# EAGLE board V2.1_BMS (EAGLE 9.6.2)
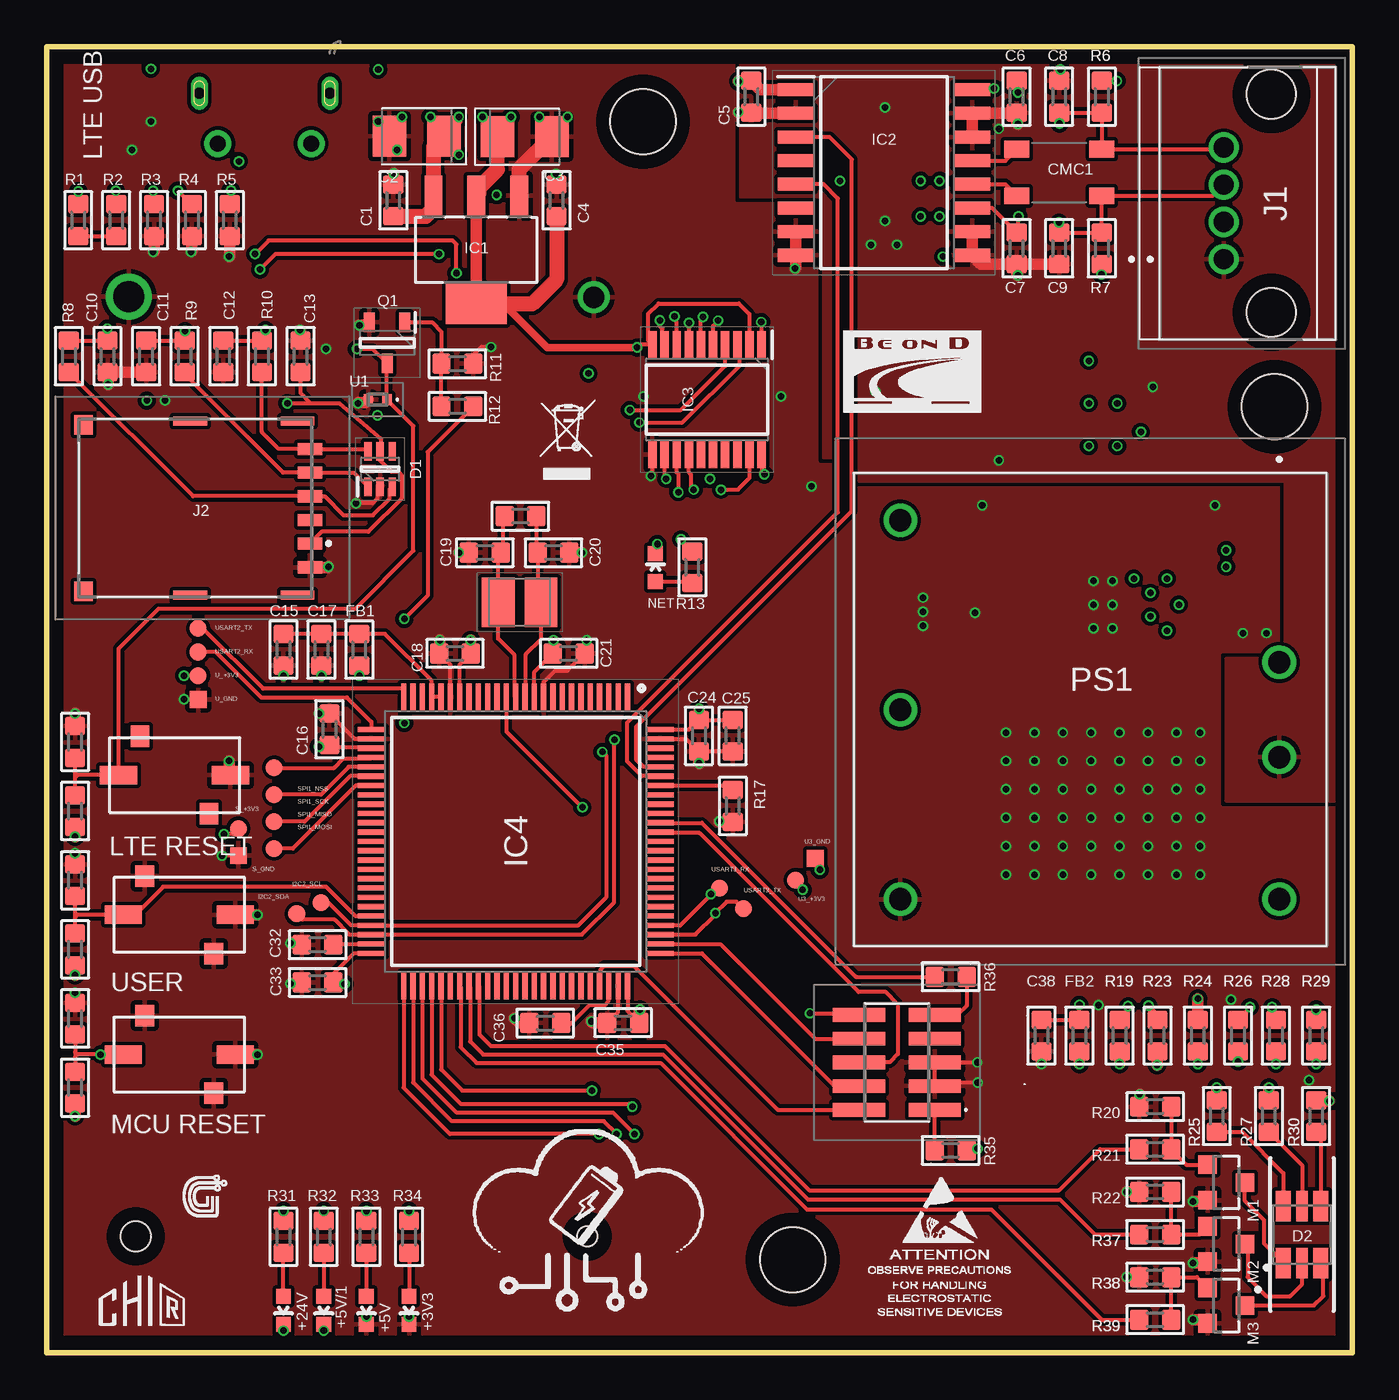
[diagram p7: board, top side]
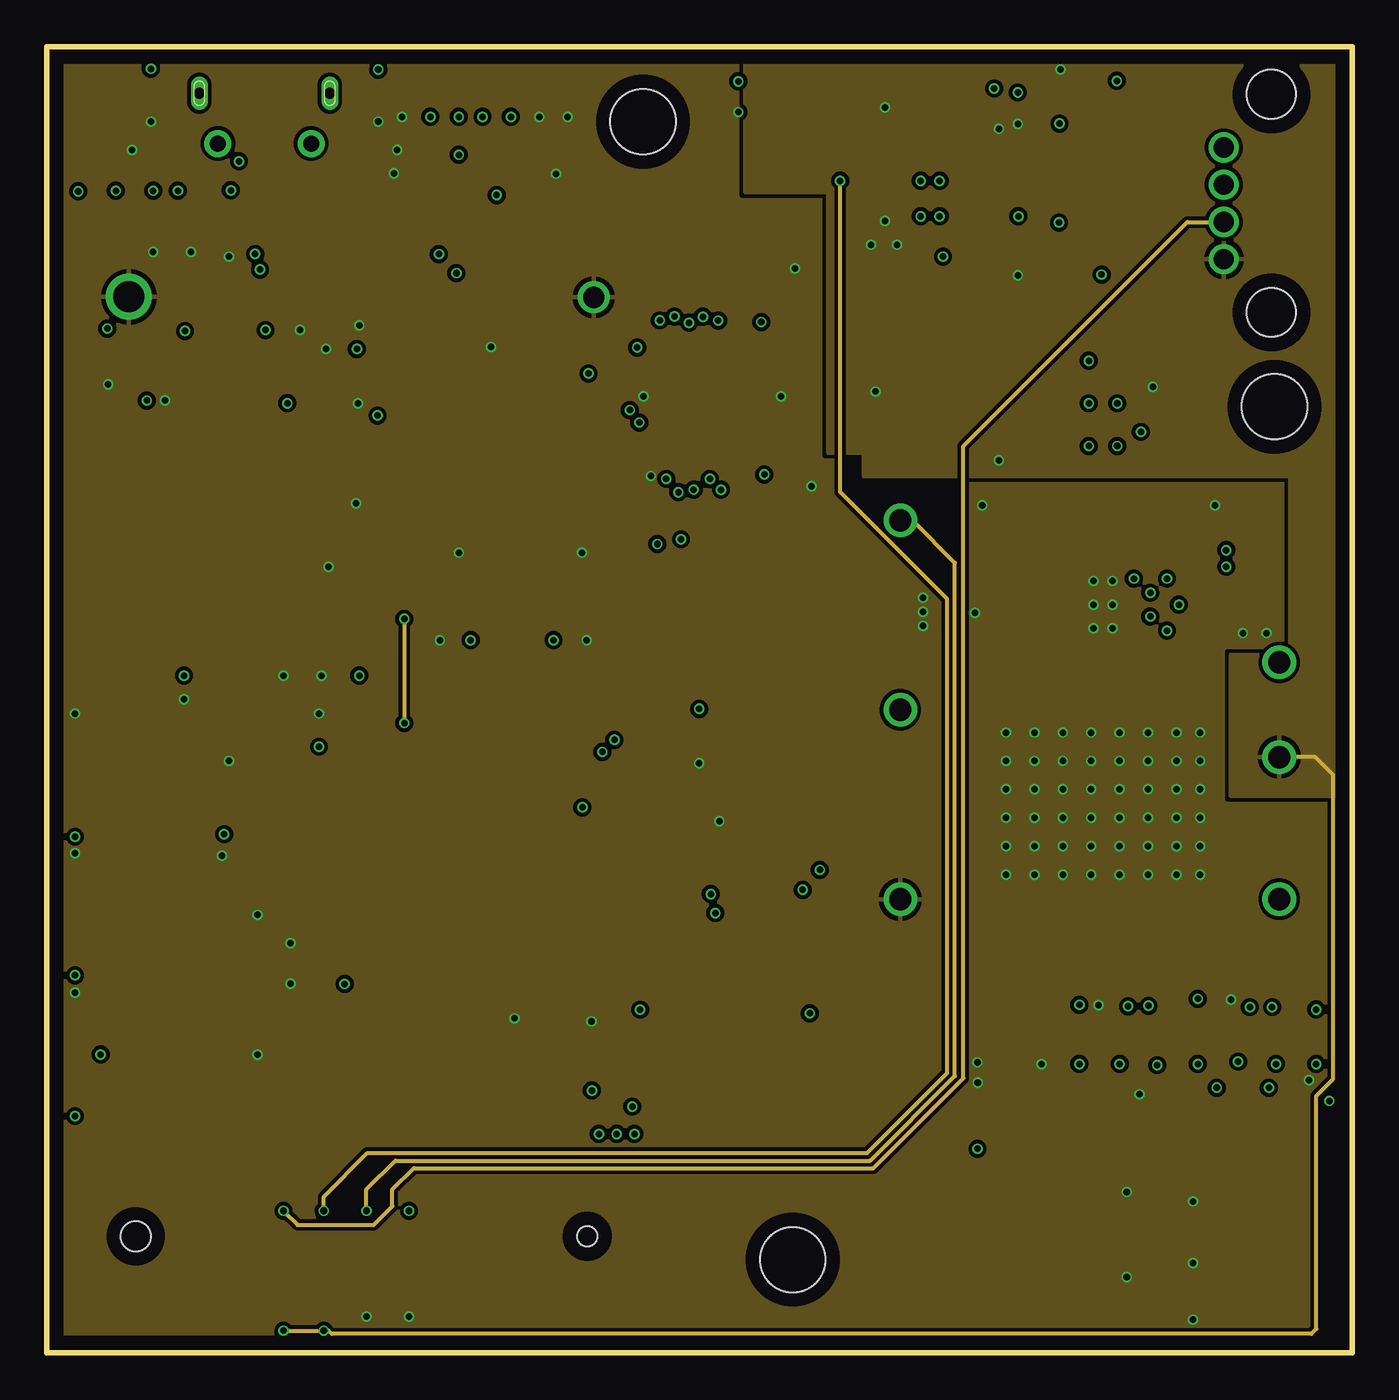
[diagram p8: board, inner layer Route2]
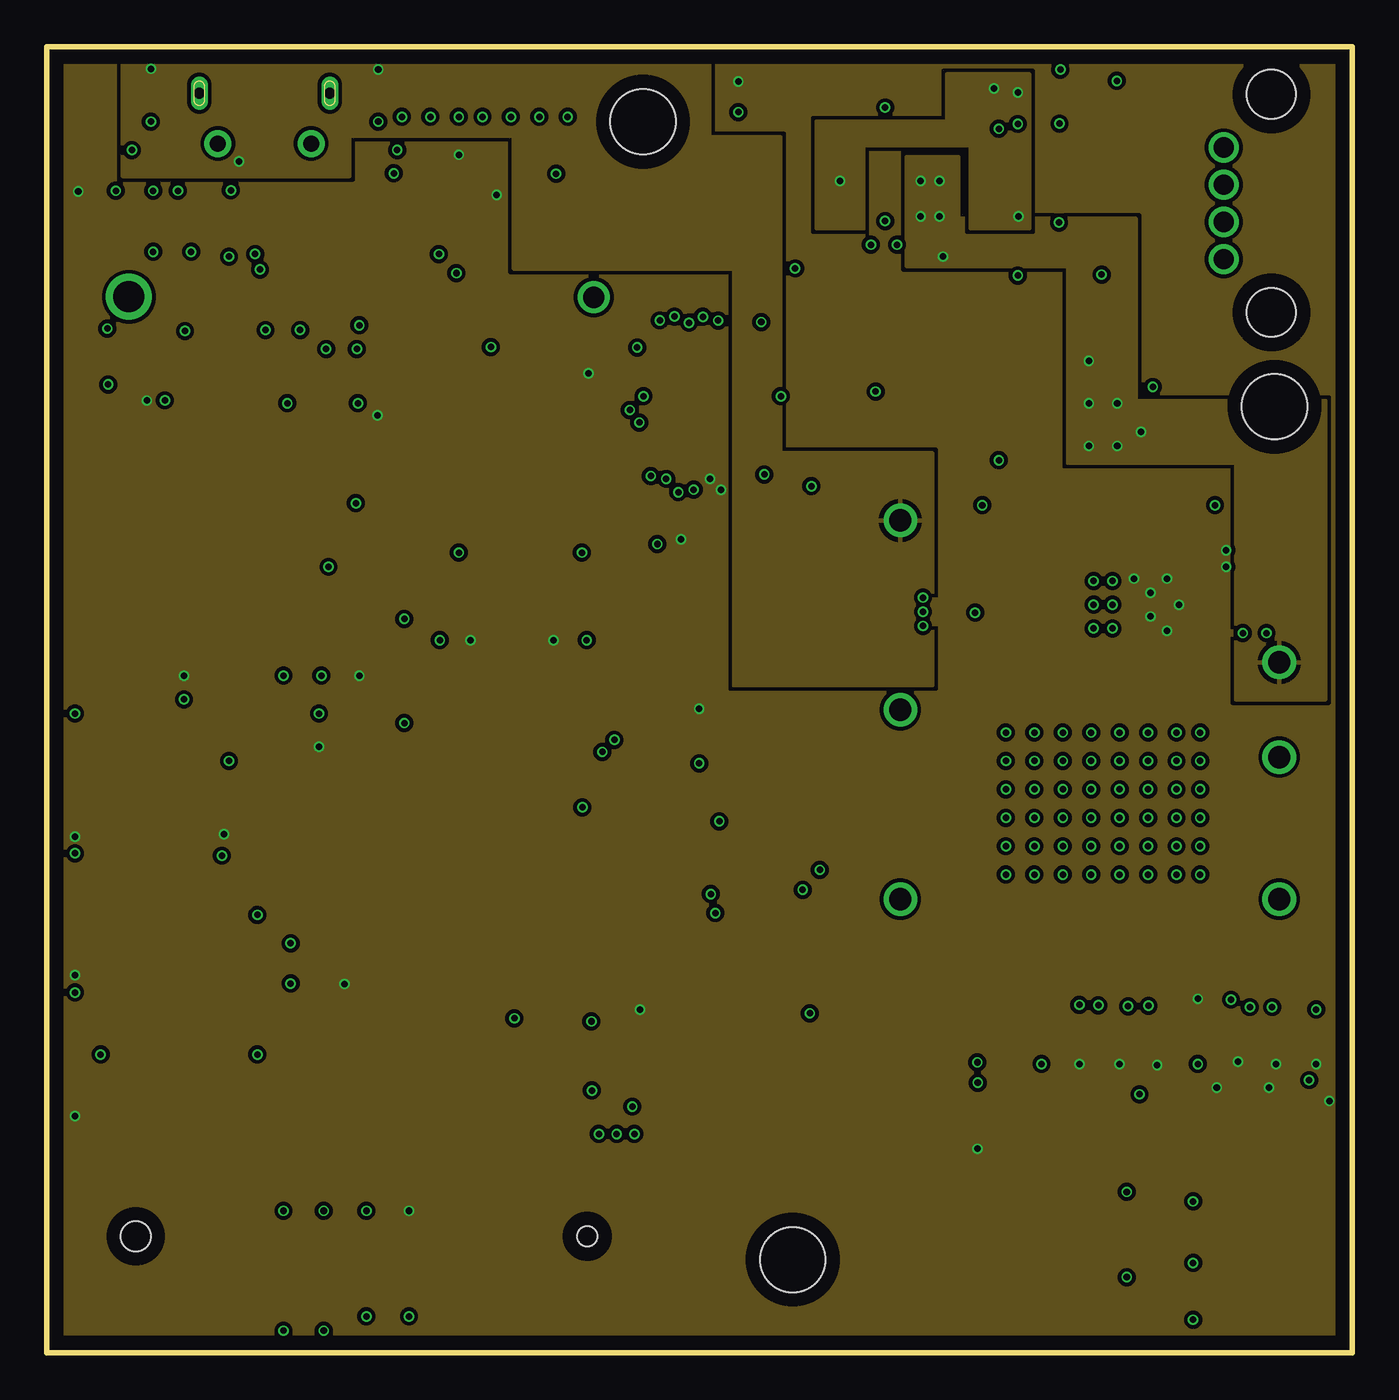
[diagram p9: board, inner layer Route15]
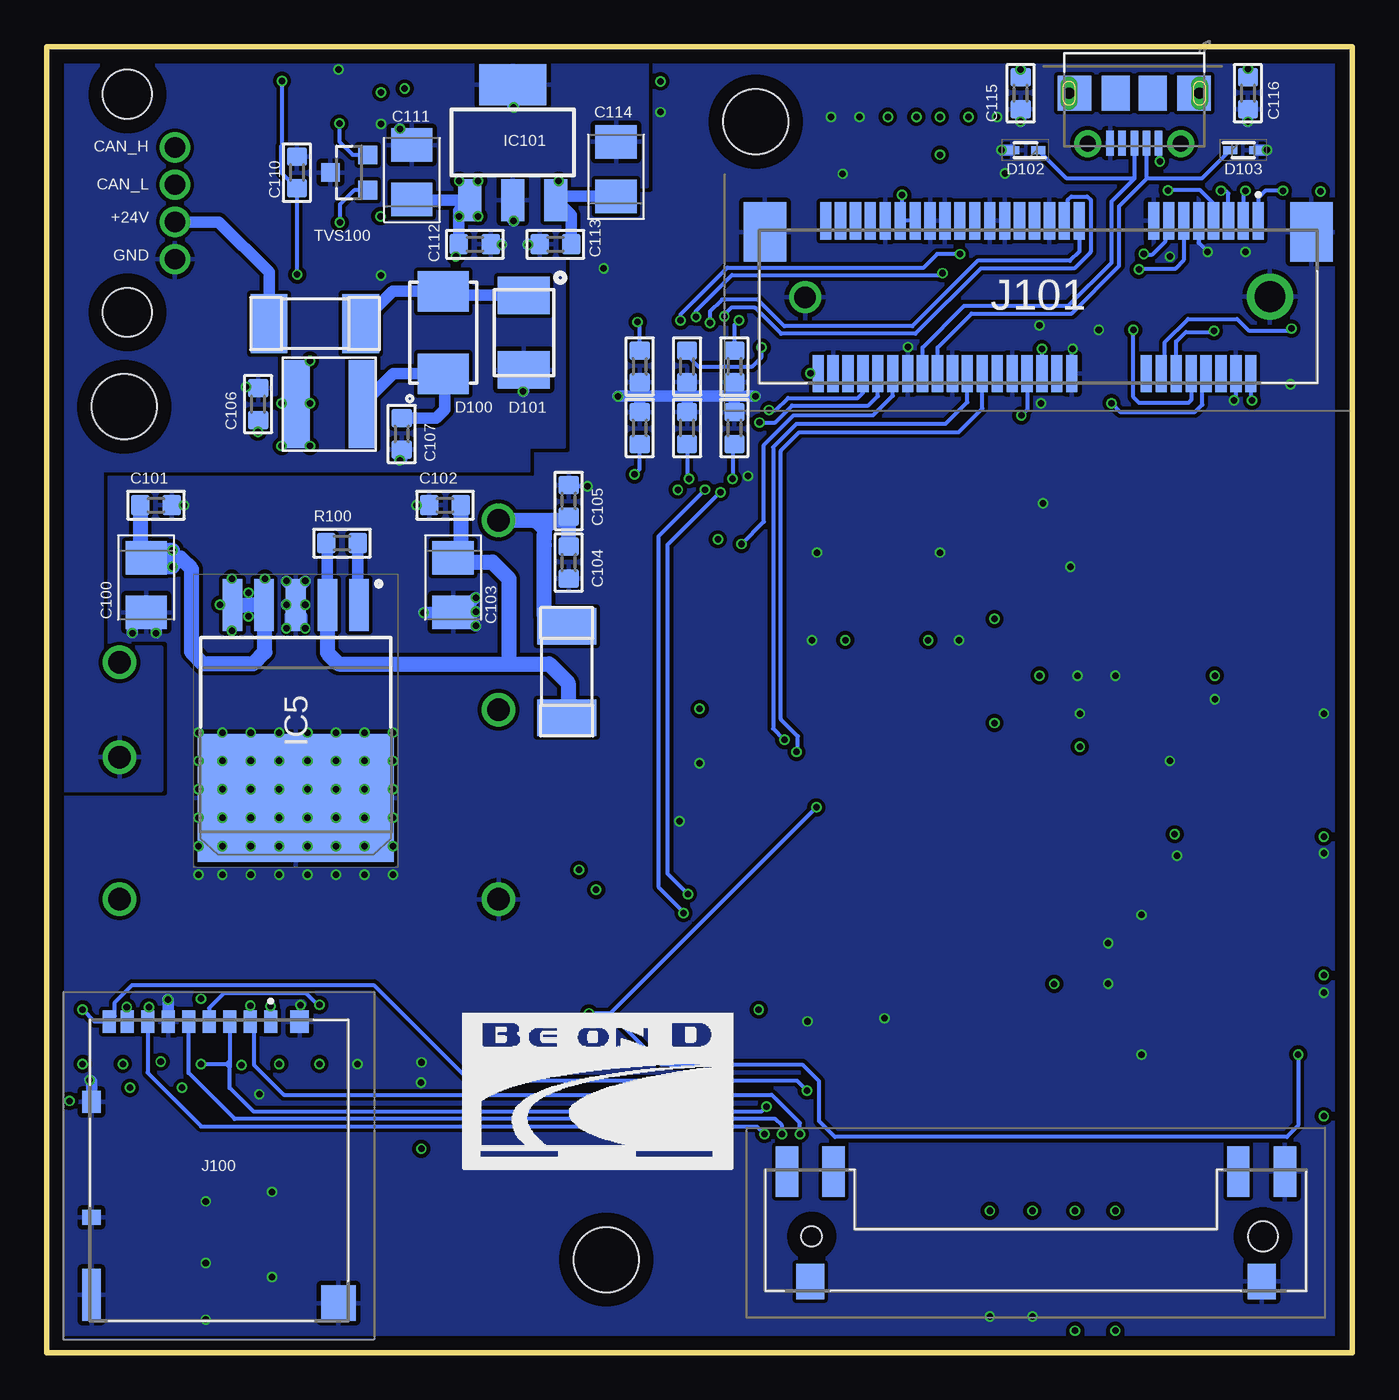
[diagram p10: board, bottom side, seen from below]

Size 70 x 70.06 mm. Coordinates in mm from the lower left corner, seen from the top.
Outline: 0,0 0,70.06 70,70.06 70,0 0,0
Copper layers (1+2*15+16): Top 0.035mm / dielectric 0.2mm / Route2 0.0175mm / dielectric 1.065mm / Route15 0.0175mm / dielectric 0.2mm / Bottom 0.035mm
Design rules "4layers_DRU *": minimum track width 8mil, minimum drill 0.2mm, track to track 8mil, track to pad 8mil, pad to pad 5mil, via to via 10mil, smd to smd 0mil, copper to edge 30mil, drill to drill 8mil, minimum pad ring 6mil, minimum via ring 4mil, stop-mask expansion 4mil, vias tented up to drill 25mil, thermal gap 10mil
Net classes: 0 default: width 0.203 mm, drill 0.2 mm, clearance 0.203 mm; 3 uC: width 0.203 mm, drill 0.2 mm, clearance 0.203 mm; 9 24v: width 0.61 mm, drill 0.2 mm, clearance 0.203 mm
Holes 3.5 mm at 40,5 65.84,50.75 31.98,66.04

## Footprints (pad centres in the part's own frame; a part is rotated, then mirrored left to right if it is on the bottom)
LED-0603 = smd 0.8 x 0.8: A 0,-0.75; C 0,0.75
BOTON_LED_SKQYACE010 = smd 2 x 1: 1 -3,0; 2 3,0 | smd 1 x 1.15: GND1 -1.85,2.075; GND2 1.85,-2.075
0603_INCH:1 = smd 1 x 1.1: 1 -0.85,0; 2 0.85,0
CAPMP3528X210N = smd 1.796 x 2.204: 1 -1.46,0; 2 1.46,0
0603_INCH = smd 1 x 1.1: 1 -0.85,0; 2 0.85,0
BEOND_L_1812ACC = smd 1.35 x 0.9: 1 -2.275,1.25; 2 -2.275,-1.25; 3 2.275,-1.25; 4 2.275,1.25
SOT65P210X110-6N = smd 1 x 0.4: 1 -0.95,0.65; 2 -0.95,0; 3 -0.95,-0.65; 4 0.95,-0.65; 5 0.95,0; 6 0.95,0.65
PLCC-6-LED_PLCC-6-LED = smd 1.65 x 0.8: AB 1.53,1; AG 1.53,-1; CB -1.53,1; CG -1.53,-1 | smd 1.65 x 0.6: AR 1.53,0; CR -1.53,0
LIBRARY_DIODES_FUSE_SMB-2 = smd 2.159 x 2.743: A 2.21,0; C -2.21,0
LIBRARY_DIODES_FUSE_SMB = smd 2 x 2.8: 1 -2,0; 2 2,0
SODFL1608X70N = smd 0.76 x 0.42: 1 -0.7,0; 2 0.7,0
LIBRARY_DIODES_FUSE_452_454 = smd 1.96 x 3.15: P$1 -2.455,0; P$2 2.455,0
TP09R = smd 0.9 x 0.9: TP 0,0
SOT223:1 = smd 0.95 x 2.15: 1 -2.3,-2.9; 2 0,-2.9; 3 2.3,-2.9 | smd 3.25 x 2.15: 4 0,2.9
TJA1052IT_2Y_SOIC127P1032X265-16N = smd 1.95 x 0.7: 1 -4.725,4.445; 2 -4.725,3.175; 3 -4.725,1.905; 4 -4.725,0.635; 5 -4.725,-0.635; 6 -4.725,-1.905; 7 -4.725,-3.175; 8 -4.725,-4.445; 9 4.725,-4.445; 10 4.725,-3.175; 11 4.725,-1.905; 12 4.725,-0.635; 13 4.725,0.635; 14 4.725,1.905; 15 4.725,3.175; 16 4.725,4.445
SOP65P640X120-20N = smd 1.475 x 0.45: 1 -2.938,2.925; 2 -2.938,2.275; 3 -2.938,1.625; 4 -2.938,0.975; 5 -2.938,0.325; 6 -2.938,-0.325; 7 -2.938,-0.975; 8 -2.938,-1.625; 9 -2.938,-2.275; 10 -2.938,-2.925; 11 2.938,-2.925; 12 2.938,-2.275; 13 2.938,-1.625; 14 2.938,-0.975; 15 2.938,-0.325; 16 2.938,0.325; 17 2.938,0.975; 18 2.938,1.625; 19 2.938,2.275; 20 2.938,2.925
QFP50P1600X1600X160-100N = smd 1.475 x 0.28: 1 -7.738,6; 2 -7.738,5.5; 3 -7.738,5; 4 -7.738,4.5; 5 -7.738,4; 6 -7.738,3.5; 7 -7.738,3; 8 -7.738,2.5; 9 -7.738,2; 10 -7.738,1.5; 11 -7.738,1; 12 -7.738,0.5; 13 -7.738,0; 14 -7.738,-0.5; 15 -7.738,-1; 16 -7.738,-1.5; 17 -7.738,-2; 18 -7.738,-2.5; 19 -7.738,-3; 20 -7.738,-3.5; 21 -7.738,-4; 22 -7.738,-4.5; 23 -7.738,-5; 24 -7.738,-5.5; 25 -7.738,-6; 51 7.738,-6; 52 7.738,-5.5; 53 7.738,-5; 54 7.738,-4.5; 55 7.738,-4; 56 7.738,-3.5; 57 7.738,-3; 58 7.738,-2.5; 59 7.738,-2; 60 7.738,-1.5; 61 7.738,-1; 62 7.738,-0.5; 63 7.738,0; 64 7.738,0.5; 65 7.738,1; 66 7.738,1.5; 67 7.738,2; 68 7.738,2.5; 69 7.738,3; 70 7.738,3.5; 71 7.738,4; 72 7.738,4.5; 73 7.738,5; 74 7.738,5.5; 75 7.738,6 | smd 0.28 x 1.475: 26 -6,-7.738; 27 -5.5,-7.738; 28 -5,-7.738; 29 -4.5,-7.738; 30 -4,-7.738; 31 -3.5,-7.738; 32 -3,-7.738; 33 -2.5,-7.738; 34 -2,-7.738; 35 -1.5,-7.738; 36 -1,-7.738; 37 -0.5,-7.738; 38 0,-7.738; 39 0.5,-7.738; 40 1,-7.738; 41 1.5,-7.738; 42 2,-7.738; 43 2.5,-7.738; 44 3,-7.738; 45 3.5,-7.738; 46 4,-7.738; 47 4.5,-7.738; 48 5,-7.738; 49 5.5,-7.738; 50 6,-7.738; 76 6,7.738; 77 5.5,7.738; 78 5,7.738; 79 4.5,7.738; 80 4,7.738; 81 3.5,7.738; 82 3,7.738; 83 2.5,7.738; 84 2,7.738; 85 1.5,7.738; 86 1,7.738; 87 0.5,7.738; 88 0,7.738; 89 -0.5,7.738; 90 -1,7.738; 91 -1.5,7.738; 92 -2,7.738; 93 -2.5,7.738; 94 -3,7.738; 95 -3.5,7.738; 96 -4,7.738; 97 -4.5,7.738; 98 -5,7.738; 99 -5.5,7.738; 100 -6,7.738
TO170P1435X465-6N = smd 2.8 x 1.05: 1 -6.2,3.4; 2 -6.2,1.7; 3 -6.2,0; 4 -6.2,-1.7; 5 -6.2,-3.4 | smd 6.85 x 10.5: 6 4.15,0
SOT223 = smd 1.219 x 2.235: 1 -2.311,-3.099; 2 0,-3.099; 3 2.311,-3.099 | smd 3.6 x 2.2: 4 0,3.099
347920040 = drill 1.08 pad 1.62: 1 -3,0; 2 -1,0; 3 1,0; 4 3,0 | hole 2.63: -5.85,-2.55; 5.85,-2.55; -5.85,-2.55; 5.85,-2.55
693043020611 = smd 0.65 x 1.3: C1 1.91,5.77; C2 -0.63,5.77; C3 -1.9,5.77; C5 3.18,5.77; C6 0.64,5.77; C7 -3.17,5.77 | smd 0.48 x 1.8: P1 -4.67,5.1; P2 -4.67,-0.65; P5 4.66,-0.65; P6 4.66,5.1 | smd 1.03 x 1: P3 -4.465,-6.37; P4 4.465,-6.37
FTSH10501LDVKPTR = smd 0.74 x 2.79: 1 -2.54,-2.035; 2 -2.54,2.035; 3 -1.27,-2.035; 4 -1.27,2.035; 5 0,-2.035; 6 0,2.035; 7 1.27,-2.035; 8 1.27,2.035; 9 2.54,-2.035; 10 2.54,2.035
DM3ATSFPEJM542 = smd 0.7 x 1.2: 1 3.2,-0.1; 2 2.1,-0.1; 3 1,-0.1; 4 -0.1,-0.1; 5 -1.2,-0.1; 6 -2.3,-0.1; 7 -3.4,-0.1; 8 -4.5,-0.1; 9 -5.45,-0.1 | smd 1 x 1.2: 10 4.75,-0.1; 14 -6.4,-4.4 | smd 1.85 x 1.9: 11 6.825,-15.2 | smd 1 x 2.8: 12 -6.4,-14.75 | smd 1 x 0.8: 13 -6.4,-10.6
17758382_LATCH = smd 0.6 x 2: 1 -11.8,-3.85; 2 -11.4,4.35; 3 -11,-3.85; 4 -10.6,4.35; 5 -10.2,-3.85; 6 -9.8,4.35; 7 -9.4,-3.85; 8 -9,4.35; 9 -8.6,-3.85; 10 -8.2,4.35; 11 -7.8,-3.85; 12 -7.4,4.35; 13 -7,-3.85; 14 -6.6,4.35; 15 -6.2,-3.85; 16 -5.8,4.35; 17 -2.2,-3.85; 18 -1.8,4.35; 19 -1.4,-3.85; 20 -1,4.35; 21 -0.6,-3.85; 22 -0.2,4.35; 23 0.2,-3.85; 24 0.6,4.35; 25 1,-3.85; 26 1.4,4.35; 27 1.8,-3.85; 28 2.2,4.35; 29 2.6,-3.85; 30 3,4.35; 31 3.4,-3.85; 32 3.8,4.35; 33 4.2,-3.85; 34 4.6,4.35; 35 5,-3.85; 36 5.4,4.35; 37 5.8,-3.85; 38 6.2,4.35; 39 6.6,-3.85; 40 7,4.35; 41 7.4,-3.85; 42 7.8,4.35; 43 8.2,-3.85; 44 8.6,4.35; 45 9,-3.85; 46 9.4,4.35; 47 9.8,-3.85; 48 10.2,4.35; 49 10.6,-3.85; 50 11,4.35; 51 11.4,-3.85; 52 11.8,4.35 | smd 2.3 x 3.2: 53 -14.65,-3.25; 54 14.65,-3.25 | drill 1.65 pad 2.475: 55 -12.424,0.225 | drill 1.15 pad 1.725: 56 12.5,0.25 | smd 1.2 x 2.7: 57 -13.223,47.142; 59 -10.723,47.142; 60 10.977,47.142; 62 13.477,47.142 | smd 1.5 x 1.9: 58 -11.973,53.042; 61 12.227,53.042 | hole 1.6: -12.05,50.615 | hole 1.1: 12.15,50.615
MOLEX_105017-0001 = smd 0.4 x 1.35: 1 -1.3,2.675; 2 -0.65,2.675; 3 0,2.675; 4 0.65,2.675; 5 1.3,2.675 | drill 0.85 pad 1.45: P$1 -2.5,2.7; P$2 2.5,2.7 | smd 1.5 x 1.9: P$8 -1,0; P$9 1,0 | smd 1.8 x 1.9: P$10 -3.2,0; P$11 3.2,0 | drill 0.6 pad 0.8 long: P$12 -3.5,0; P$13 3.5,0
LIBRARY_DIODES_FUSE_L_5X5 = smd 1.5 x 4.7: P$1 -1.8,0; P$2 1.8,0
BEOND_SOT23 = smd 1 x 1: 1 -0.95,-1; 2 0.95,-1; 3 0,1
THN152415WIR = drill 1.2 pad 1.8: 1 0,0; 2 -5.08,0; 3 7.62,20.32; 4 -2.54,20.32; 5 -12.7,20.32; 6 -12.7,0
SOT95P230X110-3N = smd 1.05 x 0.6: 1 -1.1,0.95; 2 -1.1,-0.95; 3 1.1,0
TP09SQ = smd 0.9 x 0.9: TP 0,0
ESD401DPYR = smd 0.5 x 0.6: 1 -0.5,0; 2 0.5,0
RESC3226X100N = smd 1.75 x 2.65: 1 -1.15,0; 2 1.15,0

## Placement (x,y rotation side)
+3V3  [LED-0603]  19.43,2.29 180 top
+5V  [LED-0603]  17.14,2.29 180 top
+5V/1  [LED-0603]  14.86,2.29 180 top
+24V  [LED-0603]  12.7,2.29 180 top
BTN1  SKQYACE010  [BOTON_LED_SKQYACE010]  6.86,30.99 180 top
BTN2  SKQYACE010  [BOTON_LED_SKQYACE010]  7.11,23.5 180 top
BTN3  SKQYACE010  [BOTON_LED_SKQYACE010]  7.11,16 180 top
C1  0.1uF  [0603_INCH:1]  18.59,61.82 90 top
C2  10uF  [CAPMP3528X210N]  19.84,65.25 180 top
C3  10uF  [CAPMP3528X210N]  25.63,65.23 0 top
C4  10uF  [0603_INCH:1]  27.34,61.82 90 top
C5  0.1uF  [0603_INCH:1]  37.78,67.37 270 top
C6  0.1uF  [0603_INCH:1]  52.01,67.37 270 top
C7  0.1uF  [0603_INCH:1]  52.01,59.25 270 top
C8  10pF  [0603_INCH:1]  54.29,67.37 90 top
C9  10pF  [0603_INCH:1]  54.29,59.25 270 top
C10  22pF  [0603_INCH:1]  3.26,53.45 270 top
C11  22pF  [0603_INCH:1]  5.33,53.45 270 top
C12  22pF  [0603_INCH:1]  9.47,53.45 270 top
C13  0.1uF  [0603_INCH:1]  13.61,53.45 90 top
C14  0.1uF  [0603_INCH:1]  1.52,32.77 90 top
C15  0.1uF  [0603_INCH:1]  12.7,37.72 270 top
C16  0.1uF  [0603_INCH:1]  15.16,33.45 90 top
C17  1uF  [0603_INCH:1]  14.73,37.72 270 top
C18  0.1uF  [0603_INCH:1]  21.89,37.52 180 top
C19  27pF  [0603_INCH]  23.5,42.93 180 top
C20  27pF  [0603_INCH]  27.18,42.93 0 top
C21  0.1uF  [0603_INCH:1]  27.99,37.52 0 top
C24  0.1uF  [0603_INCH:1]  34.98,33.1 270 top
C25  4.7uF  [0603_INCH:1]  36.78,33.1 270 top
C26  0.1uF  [0603_INCH]  1.52,25.35 90 top
C31  0.1uF  [0603_INCH]  1.52,17.93 90 top
C32  2.2uF  [0603_INCH:1]  14.53,21.89 180 top
C33  0.1uF  [0603_INCH:1]  14.53,19.86 180 top
C35  0.1uF  [0603_INCH:1]  30.91,17.7 180 top
C36  2.2uF  [0603_INCH:1]  26.73,17.69 180 top
C38  1uF  [0603_INCH]  53.34,17.02 270 top
C100  10uF  [CAPMP3528X210N]  64.67,41.17 270 bottom
C101  0.1uF  [0603_INCH:1]  64.14,45.47 0 bottom
C102  1uF  [0603_INCH:1]  48.64,45.47 180 bottom
C103  10uF  [CAPMP3528X210N]  48.21,41.17 270 bottom
C104  0.1uF  [0603_INCH:1]  42.01,42.39 270 bottom
C105  10uF  [0603_INCH:1]  42.01,45.69 90 bottom
C106  10uF  [0603_INCH:1]  58.66,50.89 90 bottom
C107  10uF  [0603_INCH:1]  50.97,49.29 270 bottom
C108  0.1uF  [0603_INCH:1]  35.66,49.61 90 bottom
C109  0.1uF  [0603_INCH:1]  35.66,52.91 270 bottom
C110  4.7nF  [0603_INCH:1]  56.58,63.31 90 bottom
C111  10uF  [CAPMP3528X210N]  50.42,63.32 90 bottom
C112  0.1uF  [0603_INCH:1]  47.04,59.46 0 bottom
C113  0.1uF  [0603_INCH:1]  42.72,59.46 180 bottom
C114  10uF  [CAPMP3528X210N]  39.47,63.5 90 bottom
C115  10uF  [0603_INCH:1]  17.78,67.56 270 bottom
C116  0.1uF  [0603_INCH:1]  5.59,67.56 270 bottom
CMC1  PE-1812ACC101STS  [BEOND_L_1812ACC]  54.29,63.31 0 top
D1  SMF05C.TCT  [SOT65P210X110-6N]  17.88,47.4 90 top
D2  SLV6A-FKB-CK1P1G1BB7R3R3  [PLCC-6-LED_PLCC-6-LED]  67.31,6.35 90 top
D100  NRVTSS5100ET3G  [LIBRARY_DIODES_FUSE_SMB-2]  48.73,54.72 90 bottom
D101  P0300SCLRP  [LIBRARY_DIODES_FUSE_SMB]  44.41,54.72 270 bottom
D102  EDZCVT2R6.8B  [SODFL1608X70N]  17.53,64.52 180 bottom
D103  EDZCVT2R6.8B  [SODFL1608X70N]  5.84,64.52 0 bottom
FB1  300Ω  [0603_INCH]  16.76,37.72 90 top
FB2  300Ω  [0603_INCH]  55.37,17.02 90 top
FUSE100  0452001.NRL  [LIBRARY_DIODES_FUSE_452_454]  42.11,36.53 270 bottom
FUSE101  0452001.NRL  [LIBRARY_DIODES_FUSE_452_454]  55.61,55.21 0 bottom
I2C2_SCL  TPTP09R  [TP09R]  14.71,24.16 180 top
I2C2_SDA  TPTP09R  [TP09R]  13.41,23.55 180 top
IC1  LM1117MP-1.8  [SOT223:1]  23.04,59.16 180 top
IC2  TJA1052IT/2Y  [TJA1052IT_2Y_SOIC127P1032X265-16N]  44.89,63.31 0 top
IC3  TXB0108PWR  [SOP65P640X120-20N]  35.41,51.13 270 top
IC4  STM32F439VIT6  [QFP50P1600X1600X160-100N]  25.15,27.43 270 top
IC5  LP3856ES-3.3  [TO170P1435X465-6N]  56.64,33.91 270 bottom
IC101  NCV4274CST50T3G  [SOT223]  45.01,64.92 0 bottom
J1  34792-0040  [347920040]  63.12,61.66 90 top
J2  693043020611  [693043020611]  8.35,45.31 270 top
J3  FTSH-105-01-L-DV-K-P-TR  [FTSH10501LDVKPTR]  45.59,15.58 90 top
J100  DM3AT-SF-PEJM5_42_  [DM3ATSFPEJM542]  61.19,17.86 0 bottom
J101  1775838-2LATCH  [17758382_LATCH]  16.83,56.87 180 bottom
J102  105017-0001  [MOLEX_105017-0001]  11.68,67.56 180 bottom
L100  SRN5020TA-5R6M  [LIBRARY_DIODES_FUSE_L_5X5]  54.85,50.89 180 bottom
M1  2N7002NXAKR  [BEOND_SOT23]  63.25,9.14 270 top
M2  2N7002NXAKR  [BEOND_SOT23]  63.25,5.84 270 top
M3  2N7002NXAKR  [BEOND_SOT23]  63.25,2.54 270 top
NET  [LED-0603]  32.64,42.13 0 top
PS1  THN_15-2411WIR  [THN152415WIR]  66.09,37.03 90 top
Q1  MMBT3904VL  [SOT95P230X110-3N]  18.26,54.18 270 top
R1  1k  [0603_INCH]  1.7,60.76 90 top
R2  0  [0603_INCH]  3.73,60.76 270 top
R3  0  [0603_INCH]  5.76,60.76 270 top
R4  0  [0603_INCH]  7.79,60.76 270 top
R5  0  [0603_INCH]  9.82,60.76 270 top
R6  60.4  [0603_INCH]  56.58,67.37 270 top
R7  60.4  [0603_INCH]  56.58,59.25 270 top
R8  22  [0603_INCH]  1.19,53.45 90 top
R9  22  [0603_INCH]  7.4,53.45 90 top
R10  22  [0603_INCH]  11.54,53.45 90 top
R11  47k  [0603_INCH]  22.02,53.05 180 top
R12  4.7k  [0603_INCH]  22.02,50.77 0 top
R13  1k  [0603_INCH]  34.62,42.13 90 top
R14  1M  [0603_INCH]  25.4,44.88 0 top
R15  10k  [0603_INCH]  1.52,29.06 270 top
R16  10k  [0603_INCH]  1.52,21.64 270 top
R17  10k  [0603_INCH]  36.79,29.34 90 top
R18  10k  [0603_INCH]  1.52,14.22 270 top
R19  10k  [0603_INCH]  57.53,17.02 270 top
R20  1M  [0603_INCH]  59.44,13.21 0 top
R21  100  [0603_INCH]  59.44,10.92 180 top
R22  1M  [0603_INCH]  59.44,8.64 0 top
R23  10k  [0603_INCH]  59.56,17.02 270 top
R24  10k  [0603_INCH]  61.72,17.02 90 top
R25  510  [0603_INCH]  62.74,12.7 90 top
R26  10k  [0603_INCH]  63.88,17.02 270 top
R27  510  [0603_INCH]  65.53,12.7 90 top
R28  10k  [0603_INCH]  65.91,17.02 270 top
R29  10k  [0603_INCH]  68.07,17.02 270 top
R30  510  [0603_INCH]  68.07,12.7 90 top
R31  1k  [0603_INCH]  12.7,6.22 90 top
R32  1k  [0603_INCH]  14.86,6.22 90 top
R33  1k  [0603_INCH]  17.14,6.22 90 top
R34  510  [0603_INCH]  19.43,6.22 90 top
R35  0  [0603_INCH]  48.47,10.86 0 top
R36  NC  [0603_INCH]  48.47,20.18 180 top
R37  100  [0603_INCH]  59.44,6.35 180 top
R38  1M  [0603_INCH]  59.44,4.06 0 top
R39  100  [0603_INCH]  59.44,1.78 180 top
R100  470  [0603_INCH]  54.17,43.43 180 bottom
R103  4.7k  [0603_INCH]  38.2,49.61 270 bottom
R104  4.7k  [0603_INCH]  38.2,52.91 90 bottom
R105  4.7k  [0603_INCH]  33.12,49.61 270 bottom
R106  4.7k  [0603_INCH]  33.12,52.91 90 bottom
S_+3V3  TPTP09R  [TP09R]  10.29,28.12 0 top
S_GND  TPTP09SQ  [TP09SQ]  10.29,26.67 0 top
SPI1_MISO  TPTP09R  [TP09R]  12.19,28.5 180 top
SPI1_MOSI  TPTP09R  [TP09R]  12.19,27.05 180 top
SPI1_NSS  TPTP09R  [TP09R]  12.19,31.39 180 top
SPI1_SCK  TPTP09R  [TP09R]  12.19,29.95 180 top
TVS100  PESD1CAN,215  [BEOND_SOT23]  53.78,63.31 90 bottom
U1  ESD401DPYR  [ESD401DPYR]  17.75,51.13 180 top
U3_+3V3  TPTP09R  [TP09R]  40.16,25.36 0 top
U3_GND  TPTP09SQ  [TP09SQ]  41.21,26.52 0 top
U_+3V3  TPTP09R  [TP09R]  8.13,36.32 0 top
U_GND  TPTP09SQ  [TP09SQ]  8.13,35.05 0 top
USART2_RX  TPTP09R  [TP09R]  8.13,37.59 0 top
USART2_TX  TPTP09R  [TP09R]  8.13,38.86 0 top
USART3_RX  TPTP09R  [TP09R]  36.09,24.94 45 top
USART3_TX  TPTP09R  [TP09R]  37.36,23.81 45 top
Y1  8MHZ  [RESC3226X100N]  25.36,40.27 0 top

## Tracks (layer width: path | path; a pad name or v marks a point on that pad's centre or on a via)
+1V8  (via drill 0.35)
  Top 0.203: v31.66,53.92 31.81,54.07 IC3.10 32.24,54.31 32.24,55.71 32.81,56.28 37.11,56.28 37.68,55.72 37.68,55.04 37.68,55.03 IC3.2
  Top 0.406: v23.37,66.29 24.17,65.49 C3.1 24.17,65.57 v24.89,66.29 | v31.66,53.92 26.85,53.92 24.52,56.26 IC1.4
  Top 0.61: IC1.2 IC1.4
  Top 0.813: IC1.2 23.19,62.21 23.19,62.49 24.17,63.47 C3.1 | C4.1 27.34,57.57 26.03,56.26 IC1.4
  Bottom 0.203: C109.1 35.66,53.5 35.07,52.91 32.17,52.91 31.66,53.42 v31.66,53.92
+3V1  (via drill 0.35)
  Top 0.203: v40.54,24.84 40.16,25.22 U3_+3V3.TP
+3V3  (via drill 0.35)
  Top 0.203: C35.1 31.15,18.32 IC4.75 | R1.2 v1.7,62.3 | IC3.19 37.68,46.92 37.06,46.3 v36.16,46.3 | R28.2 v65.91,15.49 | R26.2 v63.88,15.62 | R29.2 v68.07,15.49 | FB1.1 v16.76,36.32 | v15.98,19.79 15.9,19.86 C33.1 15.38,20.33 16.48,21.43 IC4.50 | R34.2 v19.43,7.62 | R13.2 34.01,43.59 v34.01,43.64 | R35.2 49.83,10.86 v49.91,10.95 | U_+3V3.TP v7.37,36.32 | S_+3V3.TP 9.99,27.82 v9.52,27.82 | IC4.28 17.36,32.48 15.29,32.48 C16.1 | IC4.19 22.15,36.92 C18.1 | IC4.11 26.15,36.52 C21.1 27.14,38.19 v27.18,38.23 | IC4.100 34.44,33.43 34.96,33.96 C24.1 C25.1
  Top 0.406: C2.1 22.1,66.05 v22.1,66.29 | C2.1 21.3,65.06 v22.1,64.26 | C2.1 21.3,65.57 v20.57,66.29
  Top 0.508: C18.1 22.75,38.22
  Top 0.61: FB2.1 v55.37,15.49 | R19.2 v57.53,15.49 | R23.2 59.55,16.15 v59.55,15.43 | R24.2 v61.72,18.99 | v68.77,13.52 68.11,13.52 R30.2 | R27.2 v65.53,14.22 | R25.2 v62.74,14.22 | 22.75,38.22 v22.73,38.23 | C24.1 34.98,34.07 34.87,34.17 34.99,34.29 v34.99,34.54 | C16.1 15.07,32.51 v14.61,32.51 | R15.2 v1.52,27.69 | R16.2 v1.52,20.25 | R18.2 v1.52,12.7 | v31.82,18.41 31.76,18.35 C35.1 | v37.08,68.2 37.11,68.22 C5.1 38.25,67.75 IC2.1
  Top 0.813: C1.1 20.33,60.97 20.75,61.39 20.75,62.04 IC1.3 20.74,64.69 C2.1 21.3,64.79 21.16,64.65
  Bottom 0.203: C108.1 35.66,46.98 v35.56,46.87 | v24.13,62.1 24.13,60.72 J101.39 J101.41 | J101.24 17.43,50.59 v17.74,50.28 | v29.05,52.53 v29.04,52.52 J101.52 | J101.2 5.43,51.15 v5.37,51.08 | IC5.4 58.29,40.16 v58.29,41.53 | v60.07,41.53 60.04,41.5 IC5.5 | IC5.5 60.04,38.76 v60.07,38.73 | v59.18,40.77 59.18,40.11 v59.18,39.5 | IC5.5 60.68,40.11 v60.71,40.13
  Bottom 0.813: 64.67,43.05 v63.25,43.05 | v63.25,42.16 64.67,42.16 C100.1 | C101.1 64.98,42.63 C100.1 | C100.1 62.83,42.63 62.23,42.04 62.23,37.59 61.59,36.96 58.93,36.96 58.29,37.59 58.29,40.06 IC5.4 59.18,40.11 IC5.5
  pour Route15 (rank 3): -1.8,70.2 74.7,70.2 74.7,69.2 74.7,-3.5 72.6,-3.5 -1.8,-3.5
+5V  (via drill 0.35)
  Top 0.203: R33.2 v17.14,7.62
  Route2 0.203: v17.14,7.62 17.14,8.76 18.69,10.31 44.16,10.31 48.69,14.85 48.69,42.37 46.48,44.58 45.85,44.58 PS1.3
  Bottom 0.203: J102.1 10.38,63.98 v10.32,63.91 | C116.1 v5.59,68.87 | 44.2,44.65 43.48,43.94 43.31,43.94 | 43.31,43.81 42.67,44.45 42.67,44.65
  Bottom 0.61: C115.1 v17.78,68.83
  Bottom 0.813: C104.1 C105.1 42.2,44.65 42.67,44.65 43.31,44.65 | 43.31,44.65 43.69,44.65 | 43.69,44.65 44.2,44.65 | 44.2,44.65 44.7,44.65 44.83,44.65 | 43.69,44.65 44.2,44.65 | 44.2,44.65 44.83,44.65 | 44.83,44.65 PS1.3 | FUSE100.P$1 42.62,39.49 43.31,39.49 43.31,43.31 43.31,43.69 43.31,43.81 43.31,43.94 43.31,44.65
  pour Route15: 4.06,69.6 4.06,63.12 16.26,63.12 16.26,65.28 25.02,65.28 25.02,58.17 36.83,58.17 36.83,35.81 47.5,35.81 47.5,48.26 39.37,48.26 39.37,65.2 35.56,65.2 35.56,69.6
+5V/1  (via drill 0.35)
  Top 0.203: C6.1 51.96,68.18 51.96,67.71 v52.07,67.61 | IC2.11 50.7,61.4 C7.1 52.1,60.19 v52.1,60.96 | R32.2 v14.86,7.62 | IC2.16 50.74,67.75 v50.8,67.82
  Route2 0.203: v14.86,7.62 14.86,8.38 17.2,10.72 43.99,10.72 48.28,15.02 48.28,40.44 42.55,46.17 v42.55,62.87
  Bottom 0.203: 42.7,61.85 IC101.3 42.55,61.98 v42.55,62.87
  Bottom 0.61: C114.1 42.48,62.04 IC101.3 | C113.1 41.87,61.02 42.7,61.85
  pour Route15: 49.53,64.77 49.53,60.33 52.7,60.33 52.7,68.58 48.26,68.58 48.26,66.04 41.27,66.04 41.27,60.33 43.81,60.33 43.81,64.77
+24V  (via drill 0.35)
  Bottom 0.203: C112.1 48.06,59.46 v48.06,58.8 | C111.1 46.86,61.86 v46.86,60.96 | C106.1 v58.66,49.4 v58.67,49.4 | L100.P$2 56.44,50.89 56.44,51.1 57.4,51.1 v57.4,50.93
  Bottom 0.61: C112.1 47.89,61.25 IC101.1 50.38,61.82 C111.1
  other vias: 46.86,62.87 47.88,62.87 47.88,60.96 55.88,53.21 55.88,50.93 55.88,48.64 57.4,48.64
  pour Route15 (rank 2): 46.1,63.63 46.1,58.29 54.74,58.29 54.74,47.75 63.75,47.75 63.75,35.05 68.58,35.05 68.58,51.05 58.42,51.05 58.42,60.83 48.9,60.83 48.9,64.14 46.1,64.14
+24V_EXT  (via drill 0.35)
  Top 0.203: R31.2 v12.7,7.62
  Route2 0.203: v12.7,7.62 13.46,6.86 17.53,6.86 18.54,7.87 18.54,8.76 19.68,9.91 44.32,9.91 49.15,14.73 49.15,48.64 61.17,60.66 J1.2
  Bottom 0.61: FUSE101.P$1 58.07,57.97 60.76,60.66 J1.2
_USIM_CLK
  Top 0.203: D1.1 16.47,47.21 J2.C3 12.68,47.21 7.4,52.49 R9.1
_USIM_DATA
  Top 0.203: D1.6 17.1,48.48 J2.C7 12.45,48.48 11.54,49.39 R10.1
A1  (via drill 0.35)
  Top 0.203: v38.32,55.29 38.33,55.28 IC3.1
  Bottom 0.203: R104.2 38.2,55.17 v38.32,55.29
A8  (via drill 0.35)
  Top 0.203: IC3.9 33.01,54.19 33.01,54.93 32.88,55.07 v32.88,55.38
  Bottom 0.203: v32.88,55.38 33.12,55.13 R106.2
B1  (via drill 0.35)
  Top 0.203: IC3.20 38.33,47.27 v38.48,47.12
  Bottom 0.203: v38.48,47.12 38.2,47.4 R103.2
B8  (via drill 0.35)
  Top 0.203: v33.22,46.88 33.13,46.97 IC3.12
  Bottom 0.203: R105.2 33.22,48.66 v33.22,46.88
BOOT0
  Top 0.203: IC4.94 36.55,30.43 R17.2
BUTTON
  Top 0.203: R16.1 1.52,23.37 | 1.52,23.37 1.52,23.5 | 1.52,23.5 1.52,23.62 | 1.52,23.62 C26.1 | 1.52,23.5 1.65,23.5 | 1.65,23.5 BTN2.2 4.75,23.5 6.25,24.99 14.99,24.99 16.55,23.43 IC4.46 | 1.65,23.5 1.52,23.37 | 1.65,23.5 1.52,23.62
CAN1_H
  Top 0.203: IC2.13 51.4,63.94 CMC1.1
CAN1_H_EXT  (via drill 0.35)
  Top 0.203: J1.4 63.02,64.56 CMC1.4 56.57,66.51 R6.2 C8.1 54.29,65.95 v54.3,65.94
  Bottom 0.203: v54.3,65.94 54.3,64.97 53.6,64.26 TVS100.2
CAN1_L
  Top 0.203: IC2.12 51.4,62.67 CMC1.2
CAN1_L_EXT  (via drill 0.35)
  Top 0.203: J1.3 62.52,62.06 CMC1.3 56.58,62.05 R7.1 C9.1 54.29,60.62 v54.28,60.63
  Bottom 0.203: TVS100.1 53.52,62.36 54.28,61.59 v54.28,60.63
CAN1_RX
  Top 0.203: IC4.95 31.91,30.93 31.12,31.72 31.12,33.8 42.42,45.09 42.42,61.91 41.66,62.67 IC2.5
CAN1_TX
  Top 0.203: IC4.96 32.01,31.43 31.62,31.81 31.62,33.59 43.18,45.15 43.18,64.02 41.98,65.22 IC2.3
CARD_SUPPLY_CONTROL  (via drill 0.35)
  Top 0.203: v68.07,18.41 R29.1 | IC4.55 21.15,15.2 22.27,14.07 v29.24,14.07
  Bottom 0.203: v68.07,18.41 67.42,17.76 J100.9 66.34,18.06 66.34,18.8 65.41,19.74 52.47,19.74 47.34,14.61 29.77,14.61 v29.24,14.07
GND1  (via drill 0.35)
  Top 0.203: D1.2 17.74,46.31 17.74,45.83 17.48,45.57 v16.58,45.57 | R11.1 22.87,53.51 23.31,53.95 v23.82,53.95 | IC3.11 32.48,47.12 v32.4,47.03 | C15.2 v12.7,36.32 | C17.2 v14.73,36.32 | +5V.C v17.14,1.95 | +3V3.C v19.43,1.95 | v49.92,14.49 47.81,14.49 J3.3 J3.5 v49.9,15.58 | U_GND.TP v7.37,35.05 | S_GND.TP v9.4,26.67 | IC4.27 16.53,32.93 C16.2 | IC4.20 21.65,36.91 C18.2 | IC4.10 26.65,35.98 27.26,36.59 27.92,36.59 C21.2 28.96,37.63 v28.96,38.23 | IC4.99 34.29,32.93 C24.2 C25.2 | IC4.74 30.65,18.29 C35.2
  Top 0.61: C14.2 v1.52,34.29 | C1.2 18.62,62.69 v18.62,63.27 | R20.1 v58.6,13.87 | C38.2 v53.34,15.49 | R22.1 v57.91,8.64 | M1.2 62.18,8.13 v61.47,8.13 | M2.2 62.18,4.83 v61.47,4.83 | R38.1 v57.91,4.06 | M3.2 62.06,1.78 v61.47,1.78 | C18.2 21.08,37.55 v21.08,38.23 | C24.2 34.98,31.72 v34.99,31.62 | C20.2 v28.7,42.93 | C19.2 v22.1,42.93 | C16.2 v14.61,34.29 | C32.2 13.55,22.02 13.13,22.02 v13.08,21.97 | C33.2 13.39,19.86 13.34,19.81 v13.08,19.81 | BTN3.1 v11.3,16 | BTN2.1 v11.3,23.5 | v9.78,31.75 9.78,31.07 BTN1.1 | J2.C5 15.08,42.13 v15.11,42.16 | C26.2 v1.52,26.8 | C36.2 25.34,17.69 v25.08,17.95 | C35.2 29.29,17.7 v29.21,17.78 | R17.1 36.09,28.49 v36.07,28.51 | v37.08,66.55 37.11,66.52 C5.2 37.82,66.48 IC2.2 | v40.13,58.17 40.17,58.2 IC2.8 IC2.7 | R4.2 7.79,59.1 v7.75,59.05 | R3.2 5.76,59.1 v5.71,59.05 | R5.2 9.82,58.84 v9.78,58.8 | v3.3,51.94 3.3,52.57 C10.2 C11.2 | C13.2 13.59,54.33 v13.59,54.86 | Q1.2 17.15,55.12 v16.76,55.12 | U1.2 17.08,50.96 16.72,50.96 v16.69,50.93
  Top 0.813: IC1.1 25.34,63.48 C3.2
  Bottom 0.203: C105.2 41.95,46.48 v41,46.48 | J101.4 6.23,51.2 v6.34,51.09 | J101.9 8.23,59.54 v7.75,59.05 | J101.18 15.03,53.8 v14.99,53.85 | J100.10 56.44,18.6 v56.39,18.64 | IC5.3 56.16,40.11 v56.13,40.13 | IC5.3 57.15,39.6 v57.15,38.86 | IC5.3 56.13,39.6 v56.13,38.86
  Bottom 0.406: C102.2 v50.16,45.47 | C101.2 v62.64,45.47
  Bottom 0.61: C116.2 v5.59,66.04 | D103.2 v4.57,64.52 | D102.2 v18.8,64.52 | C115.2 v17.78,66.04 | v64.14,38.61 64.14,39.24 64.61,39.71 C100.2 65.19,39.71 65.41,39.5 v65.41,38.61 | J100.6 63.49,18.93 v63.5,18.95 | J100.14 67.59,14.53 v67.69,14.63 | R105.1 33.12,51.31 | 33.12,51.31 R106.1 | C108.2 35.66,51.31 | 35.66,51.31 C109.2 | R103.1 38.2,51.31 | R104.1 38.2,51.31 | 35.66,51.31 33.12,51.31 | 35.66,51.31 38.2,51.31 | 33.12,51.31 v32,51.31 | 38.2,51.31 v39.37,51.31 | C103.2 49.77,39.71 v49.78,39.7 | C103.2 47.03,39.71 v46.99,39.75 | C103.2 47.79,39.71 v46.99,40.51 | C103.2 47.72,39.71 v46.99,38.99 | 56.64,40.89 v57.15,41.4 | 56.64,40.89 IC5.3 57.13,40.11 v57.15,40.13 | 56.64,40.89 v56.13,41.4
  other vias: 51.44,33.27 51.44,31.75 51.44,30.23 51.44,28.7 51.44,27.18 51.44,25.65 52.96,25.65 52.96,27.18 52.96,28.7 52.96,30.23 52.96,31.75 52.96,33.27 54.48,33.27 54.48,31.75 54.48,30.23 54.48,28.7 54.48,27.18 54.48,25.65 56.01,25.65 56.01,27.18 56.01,28.7 56.01,30.23 56.01,31.75 56.01,33.27 57.53,33.27 57.53,31.75 57.53,30.23 57.53,28.7 57.53,27.18 57.53,25.65 59.05,25.65 59.05,27.18 59.05,28.7 59.05,30.23 59.05,31.75 59.05,33.27 60.58,33.27 60.58,31.75 60.58,30.23 60.58,28.7 60.58,27.18 60.58,25.65 61.85,25.65 61.85,27.18 61.85,28.7 61.85,30.23 61.85,31.75 61.85,33.27 1.52,19.33 27.32,63.24 26.42,66.29 27.94,66.29 19.05,66.29
  pour Top (rank 3): -2.54,71.12 -2.54,-2.54 73.9,-2.54 73.9,71.12
  pour Bottom (rank 3): -3.05,71.63 -3.05,-2.03 73.39,-2.03 73.39,71.63
  pour Route2 (rank 3): -2.16,70.61 -2.16,-3.05 74.28,-3.05 74.28,70.61
GND2  (via drill 0.35)
  Top 0.203: +24V.C v12.7,1.19 | +5V/1.C v14.86,1.19
  Top 0.61: IC2.10 IC2.9 50.09,58.4 C7.2 | v52.07,65.91 52.01,65.98 C6.2 51.97,66.48 IC2.15 IC2.14 | C8.2 54.29,68.77 v54.36,68.83 | C7.2 52.01,57.85 v52.07,57.78 | C7.2 C9.2
  Route2 0.203: v12.7,1.19 v14.86,1.19 15.11,1.19 15.29,1.02 67.82,1.02 68.09,1.28 68.09,13.79 68.98,14.69 68.98,30.99 68.02,31.95 PS1.2
  Bottom 0.203: C106.2 59.31,51.74 v59.31,51.82
  Bottom 0.61: C111.2 51.05,65.42 v51.05,65.66 | IC101.4 45.01,66.85 v44.96,66.8 | IC101.2 45.01,60.76 v44.96,60.71 | C113.2 44.17,59.46 v44.2,59.44 | C112.2 45.62,59.46 v45.59,59.44 | D101.2 44.41,51.6 v44.45,51.56 | C107.2 50.97,47.97 v51.05,47.88
  pour Route2: 63.5,29.84 63.5,37.47 66.67,37.47 66.67,46.99 43.81,46.99 43.81,48.26 41.91,48.26 41.91,62.23 37.47,62.23 37.47,69.85 69.85,69.85 69.85,29.84
  pour Bottom: 63.83,30.2 63.83,37.82 67.01,37.82 67.01,47.35 44.15,47.35 44.15,48.62 42.24,48.62 42.24,62.59 37.8,62.59 37.8,70.21 70.18,70.21 70.18,30.2
  pour Top: 63.27,29.62 63.27,37.24 66.45,37.24 66.45,46.76 43.59,46.76 43.59,48.03 41.68,48.03 41.68,62 37.24,62 37.24,69.62 69.62,69.62 69.62,29.62
GND3  (via drill 0.35)
  Top 0.203: U3_GND.TP 41.21,26.15 v41.46,25.91
I2C2_SCL  (via drill 0.35)
  Top 0.203: I2C2_SCL.TP 15.1,24.16 16.32,22.93 IC4.47 28.5,22.93 30.02,24.46 30.02,32 v29.79,32.23
  Bottom 0.203: J101.30 19.83,50.65 21.1,49.38 29.64,49.38 30.63,48.39 30.63,33.98 29.72,33.07 29.72,32.31 v29.79,32.23
I2C2_SDA  (via drill 0.35)
  Top 0.203: I2C2_SDA.TP 13.72,23.24 15.44,23.24 16.18,22.5 16.18,22.48 16.23,22.43 IC4.48 28.7,22.43 30.43,24.16 30.43,32.87 v30.44,32.88
  Bottom 0.203: v30.44,32.88 31.05,33.49 31.05,48.58 29.79,49.84 21.79,49.84 20.63,50.99 J101.32
LED_WWAN  (via drill 0.35)
  Top 0.203: NET.C 32.64,43.28 v32.74,43.38
  Bottom 0.203: v32.74,43.38 31.55,44.58 31.55,48.69 29.95,50.29 25.68,50.29 24.63,51.34 J101.42
LTE_RESET  (via drill 0.35)
  Top 0.203: R12.2 20.42,48.32 20.42,40.62 v19.18,39.37
  Route2 0.203: v19.18,39.37 v19.18,33.78
N$1
  Bottom 0.61: IC5.2 54.94,43.36 R100.2
  Bottom 0.813: IC5.2 54.94,37.54 54.36,36.96 45.21,36.96 | FUSE100.P$2 42.04,34.15 42.04,35.94 43.05,36.96 45.21,36.96 | C103.1 47.99,42.42 | 47.99,42.42 46.1,42.42 45.21,41.53 45.21,36.96 | C102.1 47.79,42.62 47.99,42.42
N$2
  Bottom 0.61: D101.1 48.52,56.72 D100.A 51.43,56.93 FUSE101.P$2
N$3
  Bottom 0.61: R100.1 53.32,40.18 IC5.1
N$7  (via drill 0.35)
  Top 0.203: R3.1 5.76,62.29 v5.71,62.33
  Bottom 0.203: v5.71,62.33 5.83,62.21 J101.3
N$8  (via drill 0.35)
  Top 0.203: R4.1 7.76,61.61 v7.04,62.33
  Bottom 0.203: v7.04,62.33 6.78,62.33 6.63,62.19 J101.5
N$11  (via drill 0.35)
  Top 0.203: v56.57,57.84 56.57,58.38 R7.2 | v57.38,68.22 R6.1
  Bottom 0.203: v56.57,57.84 v56.58,57.85 C110.1 57.43,63.31 57.43,64.71 57.38,64.77 v57.38,68.22
N$12
  Top 0.203: R12.1 21.01,50.61 21.17,50.59 R11.2 21.17,54.77 20.67,55.28 Q1.1
N$13
  Top 0.203: NET.A 34.52,41.38 R13.1
N$14  (via drill 0.35)
  Top 0.203: R19.1 57.99,18.32 v57.99,18.59
  Bottom 0.203: v57.99,18.59 J100.1
N$15
  Top 0.203: D1.3 18.39,46.31 18.39,45.83 17.5,44.94 15.91,44.94 14.91,45.94 J2.C2 7.85,45.94 R8.1
N$16  (via drill 0.35)
  Top 0.203: R28.1 65.7,18.08 v65.7,18.54
  Bottom 0.203: v65.7,18.54 65.7,17.78 J100.8
N$18  (via drill 0.35)
  Top 0.203: R5.1 9.82,62.3 v9.88,62.36
  Bottom 0.203: v9.88,62.36 8.14,62.36 7.43,61.64 J101.7
N$19  (via drill 0.35)
  Top 0.203: R2.1 3.73,62.31 v3.71,62.33
  Bottom 0.203: v3.71,62.33 4.65,62.33 5.03,61.95 J101.1
N$23
  Top 0.203: R32.1 +5V/1.A
N$24
  Top 0.203: R33.1 +5V.A
N$35
  Top 0.203: +24V.A R31.1
N$36
  Top 0.203: R34.1 +3V3.A
N$37
  Top 0.203: R35.1 J3.1
N$38
  Top 0.203: R36.1 49.32,18.61 48.83,18.12 J3.9
N$40
  Top 0.203: R27.1 67.31,10.07 D2.AR
N$41
  Top 0.203: R30.1 68.31,11.61 D2.AG
N$42
  Top 0.203: R25.1 64.1,11.85 66.31,9.64 D2.AB
N$44
  Top 0.203: R39.1 R38.2 61.67,4.06 M3.1
N$45
  Top 0.203: M3.3 67.94,2.54 68.45,3.05 68.45,4.68 D2.CG
N$46
  Top 0.203: R20.2 R21.1 61.11,10.09 M1.1
N$47
  Top 0.203: D2.CB 65.28,5.85 65.28,7.11 64.25,8.14 M1.3
N$48
  Top 0.203: M2.1 61.8,6.35 R37.1 R22.2
N$49
  Top 0.203: M2.3 64.39,5.7 64.39,4.06 65.41,3.05 66.67,3.05 67.31,3.68 D2.CR
NRST  (via drill 0.35)
  Top 0.203: C31.1 1.52,16.13 | 1.52,16.13 1.52,15.88 | 1.52,15.88 R18.1 | 1.52,15.88 1.65,16 | 1.65,16 BTN3.2 v2.9,16 | 1.65,16 1.52,16.13 | J3.10 43.49,18.19 43.36,18.06 42.9,18.06 42.75,18.21 v40.92,18.21 | IC4.14 24.65,33.34 v28.73,29.26
  Bottom 0.203: v28.73,29.26 39.78,18.21 | 39.78,18.21 v40.92,18.21 | 39.78,18.21 37.03,15.47 29.49,15.47 28.57,14.55 28.57,12.42 27.74,11.58 3.5,11.58 2.9,12.19 v2.9,16
PERST  (via drill 0.35)
  Top 0.203: R15.1 1.52,30.86 | 1.52,30.86 1.52,31.11 | 1.52,31.11 C14.1 | 1.52,31.11 1.65,30.99 | 1.65,30.99 BTN1.2 3.86,37.77 5.99,39.9 16.54,39.9 19.66,43.03 19.66,49.72 U1.1 18.25,53.07 Q1.3 17.49,53.85 v16.64,53.85 | 1.65,30.99 1.52,30.86
  Bottom 0.203: v16.64,53.85 J101.22
RCC_OSC_IN
  Top 0.203: R14.2 26.25,43 C20.1 26.33,40.45 Y1.2 26.51,38.3 25.7,37.48 25.7,35.23 IC4.12
RCC_OSC_OUT
  Top 0.203: R14.1 24.49,44.82 24.49,43.07 C19.1 24.21,42.79 Y1.1 24.21,38.31 25.09,37.43 25.09,35.23 IC4.13
RGB_B
  Top 0.203: IC4.59 23.2,19.64 23.2,17.08 23.82,16.46 33.15,16.46 40.89,8.72 54.29,8.72 56.49,10.92 R21.2
RGB_G
  Top 0.203: IC4.57 22.2,19.64 22.2,16.39 23.05,15.54 32.92,15.54 40.77,7.7 50.65,7.7 56.57,1.78 R39.2
RGB_R
  Top 0.203: IC4.58 22.7,19.64 22.7,16.7 23.4,16 33.04,16 40.81,8.22 54.31,8.22 56.19,6.35 R37.2
SIM_USB_D_N
  Bottom 0.203: J101.36 22.23,53.93 20.41,55.75 15.05,55.75 12.5,58.3 12.5,61.49 11.03,62.96 11.03,62.99 | J102.2 11.03,62.99 | D103.1 8.07,62.99 11.03,62.99
SIM_USB_D_P
  Bottom 0.203: J101.38 23.03,53.93 20.8,56.16 15.21,56.16 12.9,58.47 12.9,61.76 11.68,62.98 | J102.3 11.68,62.98 | 11.68,62.98 15.29,62.98 D102.1
SPI1_MISO
  Top 0.203: SPI1_MISO.TP 13.84,28.5 16.27,30.93 IC4.31
SPI1_MOSI
  Top 0.203: SPI1_MOSI.TP 13.2,27.05 16.58,30.43 IC4.32
SPI1_NSS
  Top 0.203: SPI1_NSS.TP 12.21,31.38 15.41,31.38 15.91,31.88 17.35,31.88 IC4.29
SPI1_SCK
  Top 0.203: SPI1_SCK.TP 14.71,29.95 16.2,31.43 IC4.30
SPI2_MISO  (via drill 0.35)
  Top 0.203: v64.52,18.54 64.52,18.5 R26.1 | v31.52,11.74 30.37,12.89 21.99,12.89 20.15,14.73 IC4.53
  Bottom 0.203: v64.52,18.54 64.52,17.83 J100.7 64.59,15.02 61.71,12.14 31.92,12.14 v31.52,11.74
SPI2_MOSI  (via drill 0.35)
  Top 0.203: R24.1 v61.72,15.49 | IC4.54 20.65,14.92 22.2,13.37 31.24,13.37 v31.4,13.21
  Bottom 0.203: J100.3 60.19,15.66 | 60.19,15.66 60.19,15.49 | 60.19,15.49 60.19,15.32 | 60.19,15.32 60.19,14.21 58.93,12.96 31.65,12.96 v31.4,13.21 | v61.72,15.49 60.35,15.49 | 60.35,15.49 60.33,15.49 | 60.19,15.49 60.33,15.49 | 60.35,15.49 60.19,15.66 | 60.33,15.49 60.33,15.46 60.19,15.32
SPI2_NSS  (via drill 0.35)
  Top 0.203: v59.08,18.62 59.56,18.14 R23.1 | IC4.51 19.15,14.22 21.62,11.74 v29.61,11.74
  Bottom 0.203: v59.08,18.62 v59.09,18.61 J100.2 58.89,17.57 58.89,15.45 57.27,13.84 31.12,13.84 29.61,12.33 v29.61,11.74
SPI2_SCK  (via drill 0.35)
  Top 0.203: v30.56,11.74 29.88,12.43 21.72,12.43 19.65,14.51 IC4.52
  Bottom 0.203: J100.5 62.39,15.02 59.92,12.55 30.92,12.55 30.56,12.19 v30.56,11.74
SYS_JTCK-SWCLK
  Top 0.203: J3.4 42.29,14.27 35.13,21.43 IC4.76
SYS_JTDI
  Top 0.203: IC4.77 36.11,21.93 41.2,16.84 43.54,16.84 J3.8
SYS_JTDO-SWO
  Top 0.203: IC4.89 32.94,27.88 35.02,27.88 43.54,19.36 44.98,19.36 45.64,18.69 45.64,16.03 45.2,15.58 J3.6
SYS_JTMS-SWDIO
  Top 0.203: J3.2 39.2,13.04 31.48,20.77 29.91,20.77 29.7,20.56 29.7,19.75 IC4.72
SYS_JTRST
  Top 0.203: IC4.90 35.13,28.43 43.39,20.18 R36.2
UART_CTS  (via drill 0.35)
  Top 0.203: IC3.5 35.73,55.08 v36.01,55.36 v36.01,55.37 | v21.03,58.93 12.27,58.93 v11.44,58.11
  Bottom 0.203: v21.03,58.93 22.25,58.93 22.97,58.22 33.5,58.22 36.01,55.71 v36.01,55.37 | J101.11 9.03,58.6 9.47,58.16 11.38,58.16 v11.44,58.11
UART_DTR  (via drill 0.35)
  Top 0.203: v31.27,50.57 34.01,50.57 36.39,52.95 IC3.4
  Bottom 0.203: J101.46 26.23,51.49 26.51,51.22 30.25,51.22 30.89,50.57 v31.27,50.57
UART_RI  (via drill 0.35)
  Top 0.203: v31.77,49.9 34.09,49.9 37.15,52.96 37.15,53.95 IC3.3
  Bottom 0.203: J101.44 25.43,51.31 25.94,50.81 30.03,50.81 30.94,49.9 v31.77,49.9
UART_RTS  (via drill 0.35)
  Top 0.203: IC3.6 35.08,55.47 v35.19,55.57 | v21.97,57.91 21.97,59.47 21.77,59.66 11.9,59.66 v11.18,58.94
  Bottom 0.203: v35.19,55.57 35.19,55.88 33.26,57.81 22.07,57.81 v21.97,57.91 | J101.13 10.03,60.52 10.03,59.59 10.71,58.91 11.15,58.91 v11.18,58.94
UART_RXD  (via drill 0.35)
  Top 0.203: v34.44,55.25 v34.43,55.24 IC3.7
  Bottom 0.203: J101.17 14.63,59.08 15.14,58.57 20.08,58.57 23.59,55.07 30.45,55.07 31.88,56.5 33.78,56.5 34.44,55.84 v34.44,55.25
UART_TXD  (via drill 0.35)
  Top 0.203: v33.67,55.59 33.67,55.42 33.75,55.34 33.75,54.1 IC3.8
  Bottom 0.203: J101.19 15.24,60.92 15.24,61.85 15.06,62.02 14.21,62.02 14.03,61.85 14.03,59.05 14.91,58.17 19.91,58.17 23.42,54.66 30.62,54.66 32.01,56.06 33.3,56.06 33.67,55.69 v33.67,55.59
USART2_RX
  Top 0.203: USART2_RX.TP 9.07,37.59 11.5,35.16 16.09,35.16 17.41,33.85 IC4.26
USART2_TX
  Top 0.203: USART2_TX.TP 8.38,38.86 11.61,35.63 19.11,35.63 19.11,35.2 IC4.25
USART3_RX  (via drill 0.35)
  Top 0.203: IC3.13 33.78,47.23 33.87,47.15 v33.87,46.16 | IC4.79 32.89,22.92 33.96,22.92 35.61,24.57 v35.61,24.61 35.94,24.94 USART3_RX.TP
  Bottom 0.203: v35.61,24.61 36.7,25.7 36.7,43.35 33.89,46.16 v33.87,46.16
USART3_TX  (via drill 0.35)
  Top 0.203: v34.69,46.3 34.55,46.45 34.55,47.12 34.43,47.23 IC3.14 | IC4.78 34.79,22.43 35.85,23.5 v35.85,23.59 36.46,24.2 36.98,24.2 USART3_TX.TP
  Bottom 0.203: v35.85,23.59 35.85,23.65 37.2,25 37.2,43.79 v34.69,46.3
USIM_CLK  (via drill 0.35)
  Top 0.203: C11.1 R9.2 7.42,54.32 v7.42,54.81
  Bottom 0.203: J101.12 9.43,54.24 8.91,54.76 7.42,54.76 v7.42,54.81
USIM_DATA  (via drill 0.35)
  Top 0.203: C12.1 R10.2 11.73,54.49 v11.73,54.86
  Bottom 0.203: J101.10 8.63,51.11 8.79,50.95 11.43,50.95 11.73,51.26 v11.73,54.86
USIM_RST  (via drill 0.35)
  Top 0.203: R8.2 C10.1 3.26,54.93 v3.25,54.94
  Bottom 0.203: J101.14 10.04,52.72 10.04,54.21 8.79,55.46 6.17,55.46 5.55,54.84 3.3,54.84 3.25,54.89 v3.25,54.94
USIM_VDD  (via drill 0.35)
  Top 0.203: J2.C1 14.76,44.04 17.25,44.04 19.04,45.83 19.04,47.08 18.86,47.26 18.5,47.26 17.88,47.87 D1.5 17.9,48.37 17.9,49.03 15.7,50.93 14.17,50.93 | 14.17,50.93 13.61,51.49 C13.1 | 14.17,50.93 v12.91,50.93 v12.9,50.93
  Bottom 0.203: J101.8 8.03,52.33 8.03,50.86 8.43,50.46 12.43,50.46 v12.9,50.93
V_USD  (via drill 0.35)
  Top 0.203: C38.1 FB2.2 v55.37,18.67
  Bottom 0.203: v55.37,18.67 55.47,18.67 56.08,19.28 60.51,19.28 61.29,18.5 J100.4
VCAP_1
  Top 0.203: C32.1 15.42,21.93 IC4.49
VCAP_2
  Top 0.203: C36.1 27.65,17.62 28.07,17.62 29.1,18.65 29.91,18.65 30.11,18.85 30.11,19.66 IC4.73
VDDA
  Top 0.203: C15.1 C17.1 FB1.2 18.14,38.57 20.65,36.06 IC4.22 IC4.21
VIN0_EXT
  Bottom 0.61: L100.P$1 51.43,52.51 D100.C 48.64,52.42 48.64,50.6 49.1,50.14 C107.1
WAKE
  Top 0.203: R1.1 R2.2

## Text on the board
tPlace: LTE USB
tNames: NET | LTE RESET | USER | MCU RESET
bNames: CAN_H | CAN_L | +24V | GND
200bmp: D:/OneDrive - Politecnico di Torino/università/CONDIVISO/BeonD/PCB_LOGO/output-onlinepngtools_bmp (1)_mono.bmp
201bmp: D:/OneDrive - Politecnico di Torino/università/CONDIVISO/BeonD/PCB_LOGO/logo_mono.bmp